# Altium schematic sheet Control.SchDoc
size A4
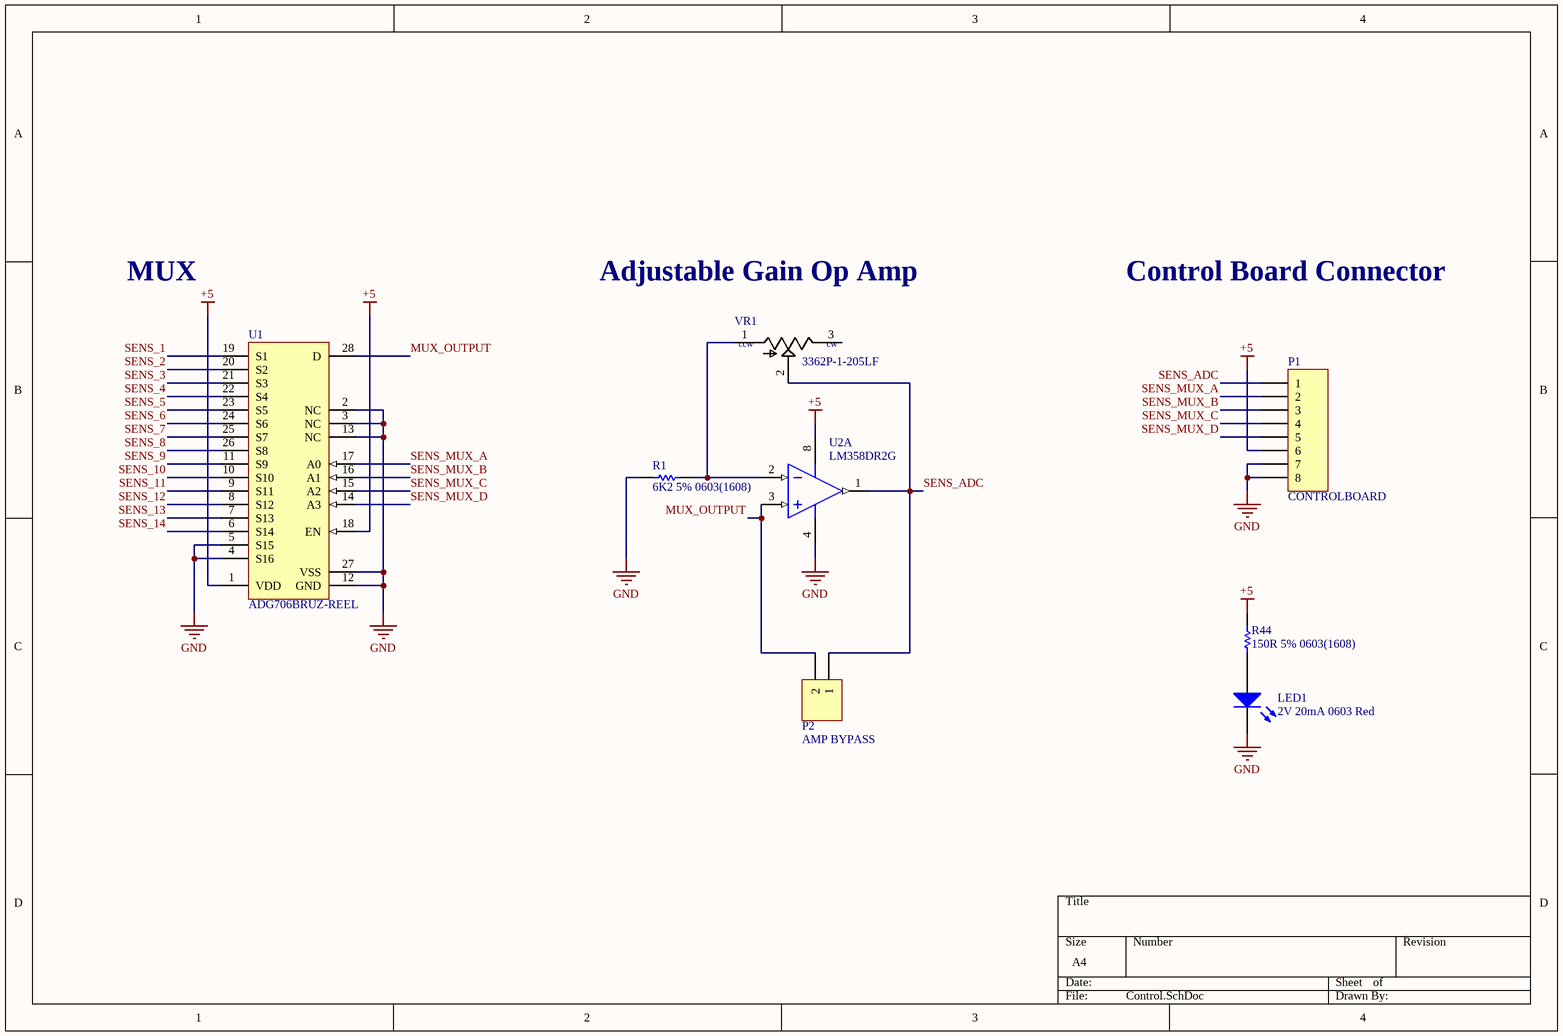
[diagram p0: Control.SchDoc]

## Parts
LED1  2V 20mA 0603 Red  [0603_A]
P1  CONTROLBOARD  [HDR1X8]
P2  AMP BYPASS  [HDR1X2]
R1  6K2 5% 0603(1608)  [RESC0603(1608)_L]
R44  150R 5% 0603(1608)  [RESC0603(1608)_L]
U1  ADG706BRUZ-REEL  [ADI-RU-28_M]
U2  LM358DR2G  [ONSC-SOIC-8-751-07_V]  (part A of 2)
VR1  3362P-1-205LF  [*TRIM_3362P-1-205LF]

## Nets
+5: P1.6 R44.2 U1.1(VDD) U1.18(EN) U2.8(VCC)
GND: LED1.1(K) P1.7 P1.8 R1.1 U1.2(NC) U1.3(NC) U1.4(S16) U1.5(S15) U1.12(GND) U1.13(NC) U1.27(VSS) U2.4(VEE/GND)
MUX_OUTPUT: P2.2 U1.28(D) U2.3(INA+)
SENS_1: U1.19(S1)
SENS_2: U1.20(S2)
SENS_3: U1.21(S3)
SENS_4: U1.22(S4)
SENS_5: U1.23(S5)
SENS_6: U1.24(S6)
SENS_7: U1.25(S7)
SENS_8: U1.26(S8)
SENS_9: U1.11(S9)
SENS_10: U1.10(S10)
SENS_11: U1.9(S11)
SENS_12: U1.8(S12)
SENS_13: U1.7(S13)
SENS_14: U1.6(S14)
SENS_ADC: P1.1 P2.1 U2.1(OUTA) VR1.2(WIPER)
SENS_MUX_A: P1.2 U1.17(A0)
SENS_MUX_B: P1.3 U1.16(A1)
SENS_MUX_C: P1.4 U1.15(A2)
SENS_MUX_D: P1.5 U1.14(A3)
NetLED1_2: LED1.2(A) R44.1
NetR1_2: R1.2 U2.2(INA-) VR1.1(CCW)

Not connected (* = marked no-connect by the designer): VR1 3(CW)

## Notes on the sheet
- MUX
- Adjustable Gain Op Amp
- Control Board Connector
- (in symbol 3362P-1-205LF) ccw; cw

## Library data of the parts
LED1 = CMP-1426-00001-1: SMD mono-color Chip LED, WL-SMCW, Red; Manufacturer: Wuerth Elektronik; PartNumber: 150060RS75000; Color: Red; PackageReference: 0603_A; ComponentLink2URL: http://katalog.we-online.com/led/datasheet/150060RS75000.pdf; ComponentLink1URL: http://www.we-online.com; ComponentLink1Description: Manufacturer URL; ComponentLink2Description: Datasheet
P1 = Header 8: Header, 8-Pin; System: Connector; LatestRevisionDate: 17-Jul-2002; LatestRevisionNote: Re-released for DXP Platform.; Publisher: Altium Limited
P2 = Header 2: Header, 2-Pin; LatestRevisionDate: 17-Jul-2002; LatestRevisionNote: Re-released for DXP Platform.; Publisher: Altium Limited
R1 = CMP-1012-00093-1: 6K2 0.1W 5% 0603 (1608 Metric)  SMD; Case-Metric: 1608; Value: 6200.00 Ohm; Case-EIA: 0603; Tolerance: 5 %; Power: 0.1 W; Technology: SMT
R44 = CMP-1012-00054-1: 150R 0.1W 5% 0603 (1608 Metric)  SMD; Case-EIA: 0603; Value: 150.00 Ohm; Case-Metric: 1608; Power: 0.1 W; Tolerance: 5 %; Technology: SMT
U1 = CMP-0798-00220-1: 1.8 to 5.5 V / 2.5 V, CMOS Low-Voltage 2.5 Ohm, 16-Channel Multiplexer, -40 to 85 degC, 28-pin SOP (RU-28), Reel; Manufacturer: Analog Devices; Supply V Guar Performance: Dual_(+/-2.5V), Single_(+3V), Single_(+5V); t transition (s): 40n; Bandwidth (Hz): 25M; Max Analog Signal Range: Vss to Vdd; Ron (ohms): 2.5; PackageDescription: 28-Pin Thin Shrink Small Outline Package, Body 9.7 x 4.4 mm, Pitch 0.65 mm; Mounting Technology: Surface Mount; ComponentLink2Description: Datasheet; Code_JEDEC: MO-153-AE; PackageReference: RU-28; ComponentLink2URL: http://www.analog.com/static/imported-files/data_sheets/ADG706_707.pdf; DatasheetVersion: Rev. A; PartNumber: ADG706BRUZ-REEL; ComponentLink3URL: http://www.analog.com/static/imported-files/packages/249854663RU_28.pdf; ComponentLink1Description: Manufacturer URL; ComponentLink3Description: Package Specification; ComponentLink1URL: http://www.analog.com/en/index.html; Packing: Reel; PackageVersion: Mar-05
U2 = CMP-1310-00291-1: Single Supply Dual Operational Amplifier, 3 to 32 V, 0 to 70 degC, 8-Pin SOIC, Pb-Free, Tape and Reel; Manufacturer: On Semiconductor; VCC Max (V): 32; VCC Min (V): 3; Packing: Tape and Reel; ComponentLink2Description: Datasheet; RoHS: TRUE; PackageDescription: 8-Pin Small Outline Integrated Circuit, Body 4.9 x 3.9 mm, Pitch 1.27 mm; PackageVersion: Rev. AK, 02/2011; ComponentLink1URL: http://www.onsemi.com/; ComponentLink1Description: Manufacturer URL; Mounting Technology: Surface Mount; ComponentLink3Description: Package Specification; ComponentLink3URL: http://www.onsemi.com/pub_link/Collateral/751-07.PDF; ComponentLink2URL: http://www.onsemi.cn/pub_link/Collateral/LM358-D.PDF; DatasheetVersion: Rev. 27; PackageReference: SOIC-8-751-07; PartNumber: LM358DR2G
VR1 = 3362P-1-205LF: Res Cermet Trimmer 2M Ohm 10% 1/2W 1_Elec_/1_Mech_Turn 2.77mm _6.6 X 6.99 X 4.7mm_ Pin Thru-Hole Tube; MF: Bourns; Package: 2220 Bourns; Price: None; MP: 3362P-1-205LF; Availability: Unavailable; SnapEDA_Link: https://www.snapeda.com/parts/3362P-1-205LF/Bourns%20-%20J.W.%20Miller/view-part/?ref=snap; Value: *